# Altium project vme6U_carrier_Cyc_V_SoC.PrjPcb (part 7 of 8)

## Sheet DiagrammaStrutturale.SchDoc
size 420 x 297 mm; Address1: Address1; Address2: Address2; Address3: Address3; Address4: Address4; SheetNumber: 1; Scale: 1:1; Разраб.: Иванов; Обозначение документа: АБВГ.123456.001 Э3; Пров.: Петров; Утв.: Сидоров; Наименование организации: ОАО "Концерн "МПО-Гидроприбор"; Перв. применение: АБВГ.123456.000; Наименование изделия 1: Плата; Наименование изделия 2: Схема электрическая; Наименование изделия 3: принципиальная; Нач. отд.: Нач. отд.; Фамилия нач. отд.: Сидоров
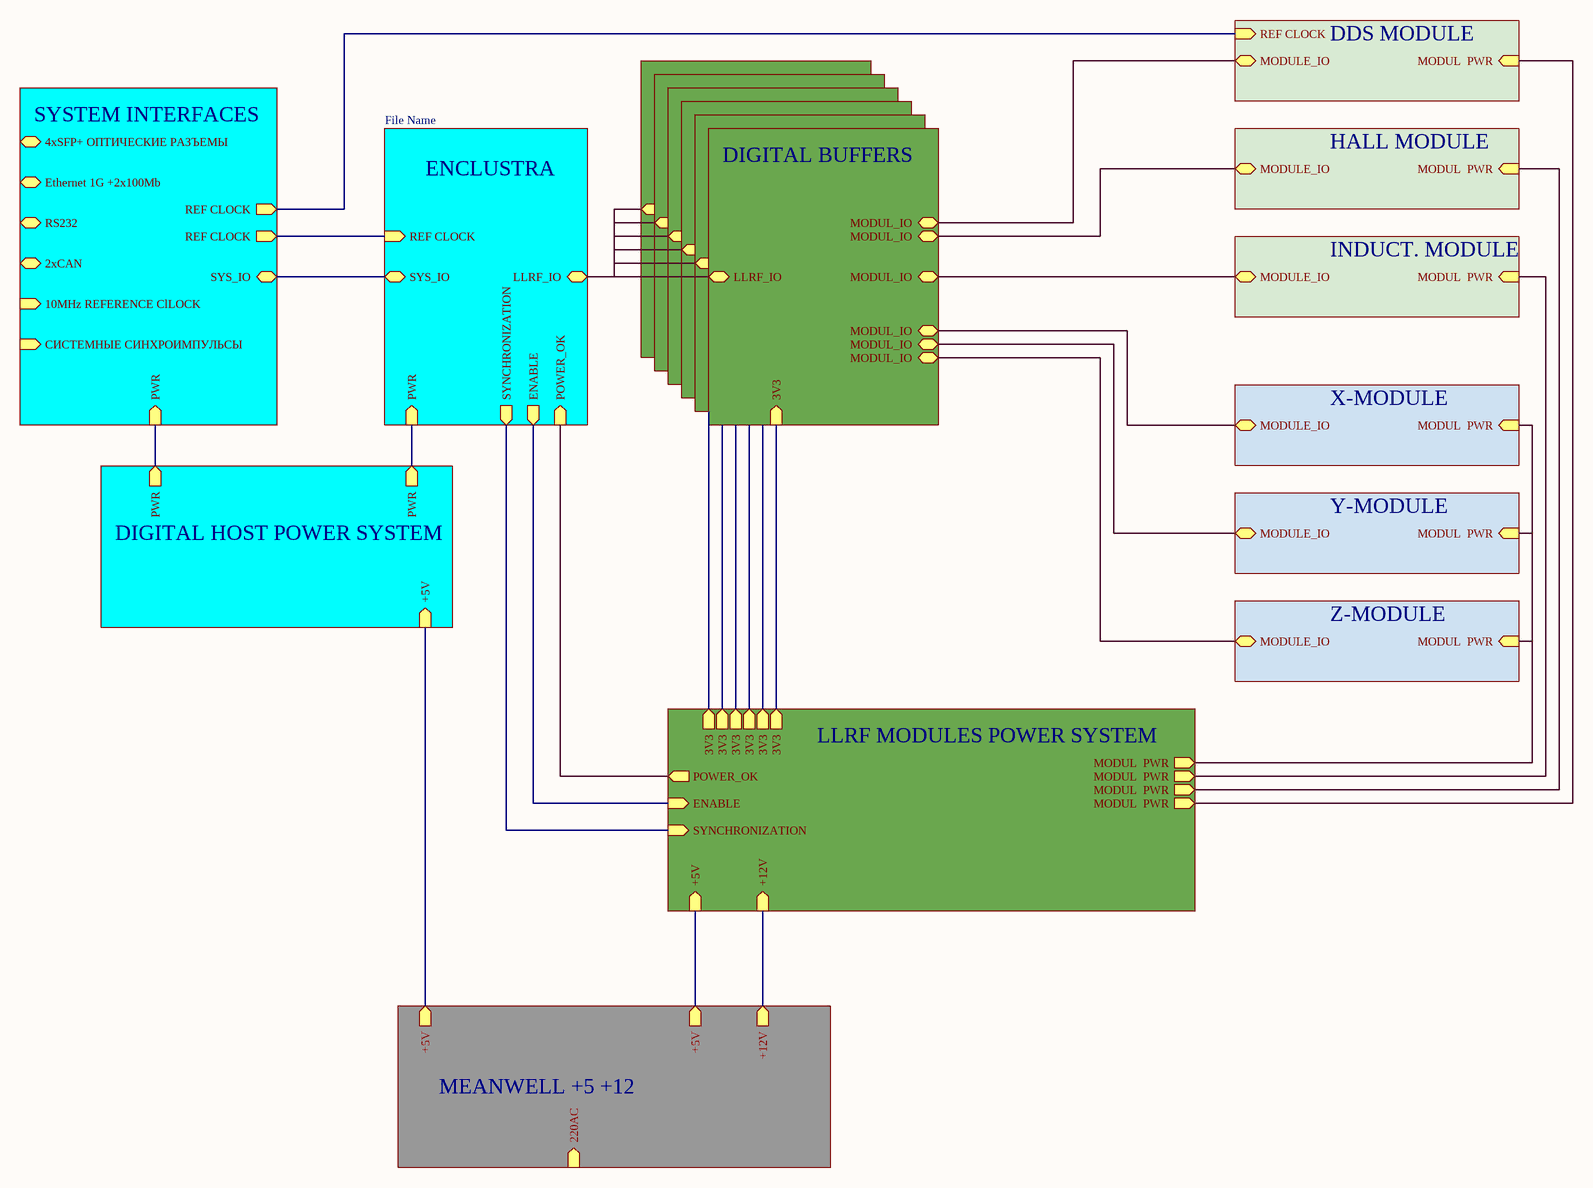
[diagram p25: DiagrammaStrutturale.SchDoc]

### Sub-sheets
DDS MODULE = File Name (file not in this document): MODUL  PWR (in), REF CLOCK (in), MODULE_IO (bidir)
DIGITAL BUFFERS = File Name (file not in this document): LLRF_IO (bidir), 3V3 (in), MODUL_IO (bidir)
DIGITAL BUFFERS = File Name (file not in this document): LLRF_IO (bidir), 3V3 (in), MODUL_IO (bidir)
DIGITAL BUFFERS = File Name (file not in this document): LLRF_IO (bidir), 3V3 (in), MODUL_IO (bidir)
DIGITAL BUFFERS = File Name (file not in this document): LLRF_IO (bidir), 3V3 (in), MODUL_IO (bidir)
DIGITAL BUFFERS = File Name (file not in this document): LLRF_IO (bidir), 3V3 (in), MODUL_IO (bidir)
DIGITAL BUFFERS = File Name (file not in this document): LLRF_IO (bidir), MODUL_IO (bidir), MODUL_IO (bidir), MODUL_IO (bidir), MODUL_IO (bidir), MODUL_IO (bidir), MODUL_IO (bidir), 3V3 (in)
DIGITAL HOST POWER SYSTEM = File Name (file not in this document): +5V (in), PWR (out), PWR (out)
ENCLUSTRA = File Name (file not in this document): PWR (in), SYS_IO (bidir), LLRF_IO (bidir), POWER_OK (in), REF CLOCK (in), ENABLE (out), SYNCHRONIZATION (out)
HALL MODULE = File Name (file not in this document): MODUL  PWR (in), MODULE_IO (bidir)
INDUCT. MODULE = File Name (file not in this document): MODUL  PWR (in), MODULE_IO (bidir)
LLRF MODULES POWER SYSTEM = File Name (file not in this document): 3V3 (out), +5V (in), +12V (in), 3V3 (out), 3V3 (out), 3V3 (out), 3V3 (out), 3V3 (out), MODUL  PWR (out), MODUL  PWR (out), MODUL  PWR (out), MODUL  PWR (out), POWER_OK (out), ENABLE (in), SYNCHRONIZATION (in)
MEANWELL +5 +12 = File Name (file not in this document): +5V (out), +5V (out), +12V (out), 220AC (in)
SYSTEM INTERFACES = File Name (file not in this document): 4xSFP+ ОПТИЧЕСКИЕ РАЗЪЕМЫ (bidir), Ethernet 1G +2x100Mb (bidir), RS232 (bidir), 2xCAN (bidir), 10MHz REFERENCE ClLOCK (in), СИСТЕМНЫЕ СИНХРОИМПУЛЬСЫ (in), SYS_IO (bidir), PWR (in), REF CLOCK (out), REF CLOCK (out)
X-MODULE = File Name (file not in this document): MODUL  PWR (in), MODULE_IO (bidir)
Y-MODULE = File Name (file not in this document): MODUL  PWR (in), MODULE_IO (bidir)
Z-MODULE = File Name (file not in this document): MODUL  PWR (in), MODULE_IO (bidir)

### Nets
(unnamed): sheet SYSTEM INTERFACES/SYS_IO, sheet ENCLUSTRA/SYS_IO
(unnamed): sheet SYSTEM INTERFACES/PWR, sheet DIGITAL HOST POWER SYSTEM/PWR
(unnamed): sheet SYSTEM INTERFACES/REF CLOCK, sheet ENCLUSTRA/REF CLOCK
(unnamed): sheet SYSTEM INTERFACES/REF CLOCK, sheet DDS MODULE/REF CLOCK
(unnamed): sheet ENCLUSTRA/PWR, sheet DIGITAL HOST POWER SYSTEM/PWR
(unnamed): sheet ENCLUSTRA/ENABLE, sheet LLRF MODULES POWER SYSTEM/ENABLE
(unnamed): sheet ENCLUSTRA/SYNCHRONIZATION, sheet LLRF MODULES POWER SYSTEM/SYNCHRONIZATION
(unnamed): sheet MEANWELL +5 +12/+5V, sheet DIGITAL HOST POWER SYSTEM/+5V
(unnamed): sheet MEANWELL +5 +12/+5V, sheet LLRF MODULES POWER SYSTEM/+5V
(unnamed): sheet MEANWELL +5 +12/+12V, sheet LLRF MODULES POWER SYSTEM/+12V
(unnamed): sheet LLRF MODULES POWER SYSTEM/3V3, sheet DIGITAL BUFFERS/3V3

### Buses and harness runs
bus sheet DDS MODULE/MODUL  PWR = sheet LLRF MODULES POWER SYSTEM/MODUL  PWR
bus sheet DDS MODULE/MODULE_IO = sheet DIGITAL BUFFERS/MODUL_IO
bus sheet DIGITAL BUFFERS/LLRF_IO = sheet ENCLUSTRA/LLRF_IO
bus sheet DIGITAL BUFFERS/MODUL_IO = sheet HALL MODULE/MODULE_IO
bus sheet DIGITAL BUFFERS/MODUL_IO = sheet INDUCT. MODULE/MODULE_IO
bus sheet DIGITAL BUFFERS/MODUL_IO = sheet X-MODULE/MODULE_IO
bus sheet DIGITAL BUFFERS/MODUL_IO = sheet Y-MODULE/MODULE_IO
bus sheet DIGITAL BUFFERS/MODUL_IO = sheet Z-MODULE/MODULE_IO
bus sheet ENCLUSTRA/POWER_OK = sheet LLRF MODULES POWER SYSTEM/POWER_OK
bus sheet HALL MODULE/MODUL  PWR = sheet LLRF MODULES POWER SYSTEM/MODUL  PWR
bus sheet INDUCT. MODULE/MODUL  PWR = sheet LLRF MODULES POWER SYSTEM/MODUL  PWR
bus sheet LLRF MODULES POWER SYSTEM/MODUL  PWR = sheet X-MODULE/MODUL  PWR = sheet Y-MODULE/MODUL  PWR = sheet Z-MODULE/MODUL  PWR

### Notes on the sheet
- Перв. примен.
- Справ. №
- Подп. и дата
- Инв. № дубл.
- Взам. инв. №
- Разраб.
- Изм.
- Лист
- № докум.
- Подп.
- Дата
- Лит.
- Масса
- Масштаб
- Пров.
- Т.контр.
- Листов
- Инв. № подл.
- Утв.
- Н.контр.
- Копировал
- Формат А3

## Sheet PowerSys.DiagrammaStrutturaleH.SchDoc
size 420 x 297 mm; Address1: Address1; Address2: Address2; Address3: Address3; Address4: Address4; SheetNumber: 1; Scale: 1:1; Разраб.: Иванов; Обозначение документа: АБВГ.123456.001 Э3; Пров.: Петров; Утв.: Сидоров; Наименование организации: ОАО "Концерн "МПО-Гидроприбор"; Перв. применение: АБВГ.123456.000; Наименование изделия 1: Плата; Наименование изделия 2: Схема электрическая; Наименование изделия 3: принципиальная; Нач. отд.: Нач. отд.; Фамилия нач. отд.: Сидоров
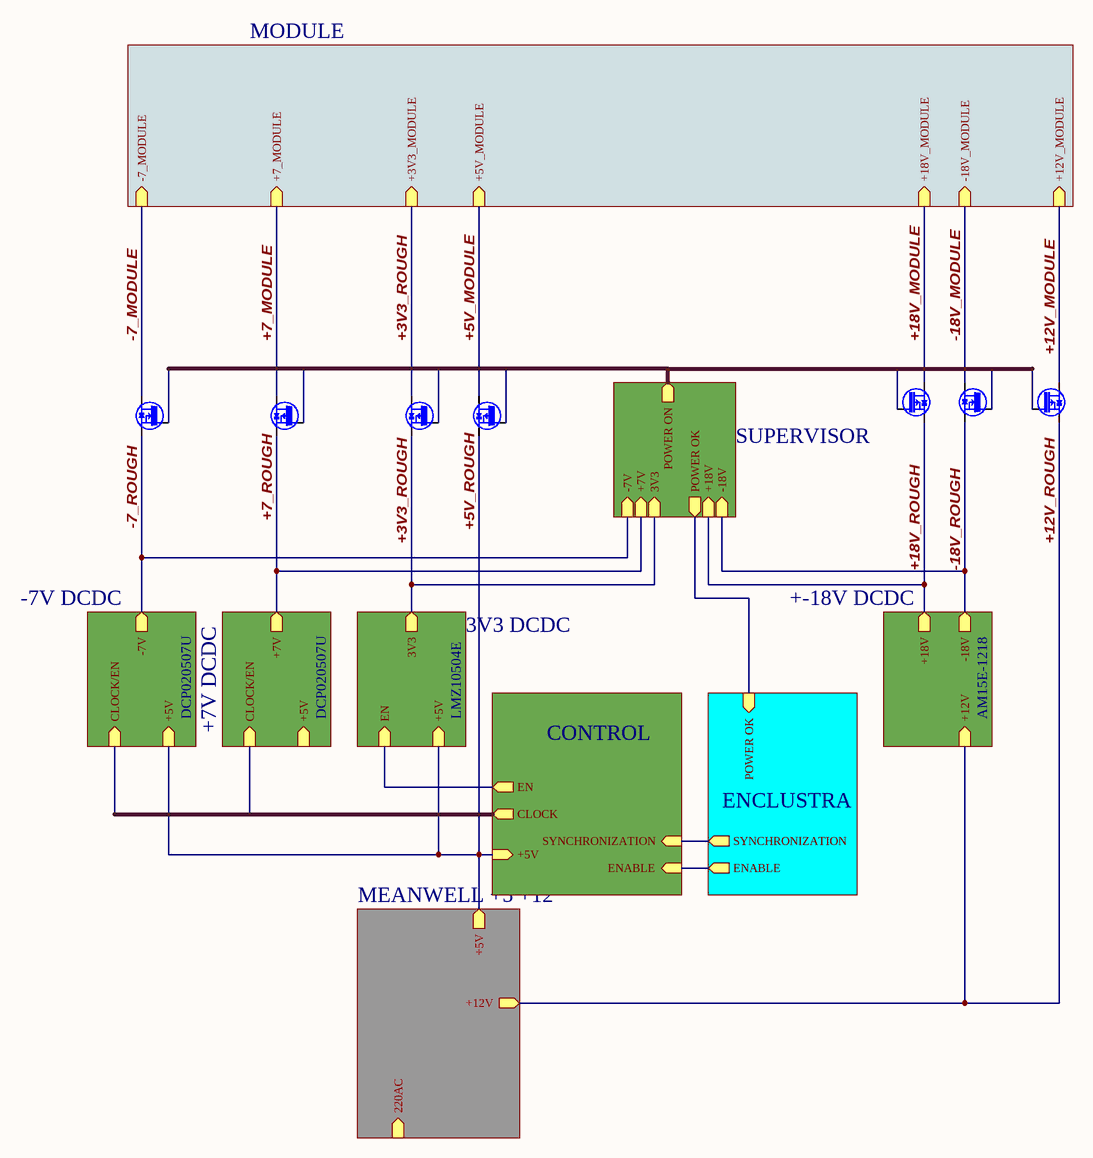
[diagram p26: PowerSys.DiagrammaStrutturaleH.SchDoc]

### Parts
(Parts that share a designator on the sheet are numbered #1, #2 ... from top to bottom, then left to right.)
Q?#1  AO3401A  [SOT95P229X119-3N]  (value not drawn)
Q?#2  AO3400A  [SOT95P229X119-3N]  (value not drawn)
Q?#3  AO3401A  [SOT95P229X119-3N]  (value not drawn)
Q?#4  AO3400A  [SOT95P229X119-3N]  (value not drawn)
Q?#5  AO3401A  [SOT95P229X119-3N]  (value not drawn)
Q?#6  AO3401A  [SOT95P229X119-3N]  (value not drawn)
Q?#7  AO3401A  [SOT95P229X119-3N]  (value not drawn)

### Sub-sheets
3V3 DCDC = File Name (file not in this document): +5V (in), EN (in), 3V3 (out)
+7V DCDC = File Name (file not in this document): +7V (out), +5V (in), CLOCK/EN (in)
+-18V DCDC = File Name (file not in this document): +18V (out), +12V (in), -18V (out)
-7V DCDC = File Name (file not in this document): -7V (out), +5V (in), CLOCK/EN (in)
CONTROL = File Name (file not in this document): ENABLE (in), SYNCHRONIZATION (in), +5V (in), CLOCK (out), EN (out)
ENCLUSTRA = File Name (file not in this document): ENABLE (out), POWER OK (in), SYNCHRONIZATION (out)
MEANWELL +5 +12 = File Name (file not in this document): +5V (out), +12V (out), 220AC (in)
MODULE = File Name (file not in this document): -18V_MODULE (in), +18V_MODULE (in), +5V_MODULE (in), +3V3_MODULE (in), +7_MODULE (in), -7_MODULE (in), +12V_MODULE (in)
SUPERVISOR = File Name (file not in this document): POWER ON (out), 3V3 (in), -18V (in), +18V (in), +7V (in), -7V (in), POWER OK (out)

### Nets
+3V3_ROUGH: Q?#6.2(S) Q?#6.3(D) ; sheet 3V3 DCDC/3V3, sheet SUPERVISOR/3V3, sheet MODULE/+3V3_MODULE
+5V_MODULE: Q?#7.3(D) ; sheet MODULE/+5V_MODULE
+5V_ROUGH: Q?#7.2(S) ; sheet MEANWELL +5 +12/+5V, sheet 3V3 DCDC/+5V, sheet CONTROL/+5V, sheet -7V DCDC/+5V
+7_MODULE: Q?#5.3(D) ; sheet MODULE/+7_MODULE
+7_ROUGH: Q?#5.2(S) ; sheet +7V DCDC/+7V, sheet SUPERVISOR/+7V
+12V_MODULE: Q?#3.3(D) ; sheet MODULE/+12V_MODULE
+12V_ROUGH: Q?#3.2(S) ; sheet MEANWELL +5 +12/+12V, sheet +-18V DCDC/+12V
+18V_MODULE: Q?#1.3(D) ; sheet MODULE/+18V_MODULE
+18V_ROUGH: Q?#1.2(S) Q?#2.2(S) ; sheet +-18V DCDC/+18V, sheet +-18V DCDC/-18V, sheet SUPERVISOR/-18V, sheet SUPERVISOR/+18V  [also labelled -18V_ROUGH]
-7_MODULE: Q?#4.3(D) ; sheet MODULE/-7_MODULE
-7_ROUGH: Q?#4.2(S) ; sheet -7V DCDC/-7V, sheet SUPERVISOR/-7V
-18V_MODULE: Q?#2.3(D) ; sheet MODULE/-18V_MODULE
(unnamed): sheet 3V3 DCDC/EN, sheet CONTROL/EN
(unnamed): sheet CONTROL/ENABLE, sheet ENCLUSTRA/ENABLE
(unnamed): sheet CONTROL/SYNCHRONIZATION, sheet ENCLUSTRA/SYNCHRONIZATION
(unnamed): sheet ENCLUSTRA/POWER OK, sheet SUPERVISOR/POWER OK

Not connected (* = marked no-connect by the designer): Q?#1 1(G); Q?#2 1(G); Q?#3 1(G); Q?#4 1(G); Q?#5 1(G); Q?#6 1(G); Q?#7 1(G)

### Notes on the sheet
- DCP020507U
- LMZ10504E
- AM15E-1218
- Подп. и дата
- Инв. № дубл.
- Взам. инв. №
- Инв. № подл.
- Изм.
- Лист
- № докум.
- Подп.
- Дата
- Копировал
- Формат А3

### Library data of the parts
Q?#1 Q?#3 Q?#5-Q?#7 = AO3401A: as Q19 on sheet DCDC_DDS; Price: 10; Device: AO3401A; Name to order: AO3401A
Q?#2 Q?#4 = AO3400A: as Q15-Q17 on sheet DCDC_DDS; Price: 10; Device: AO3400A; Name to order: AO3400A